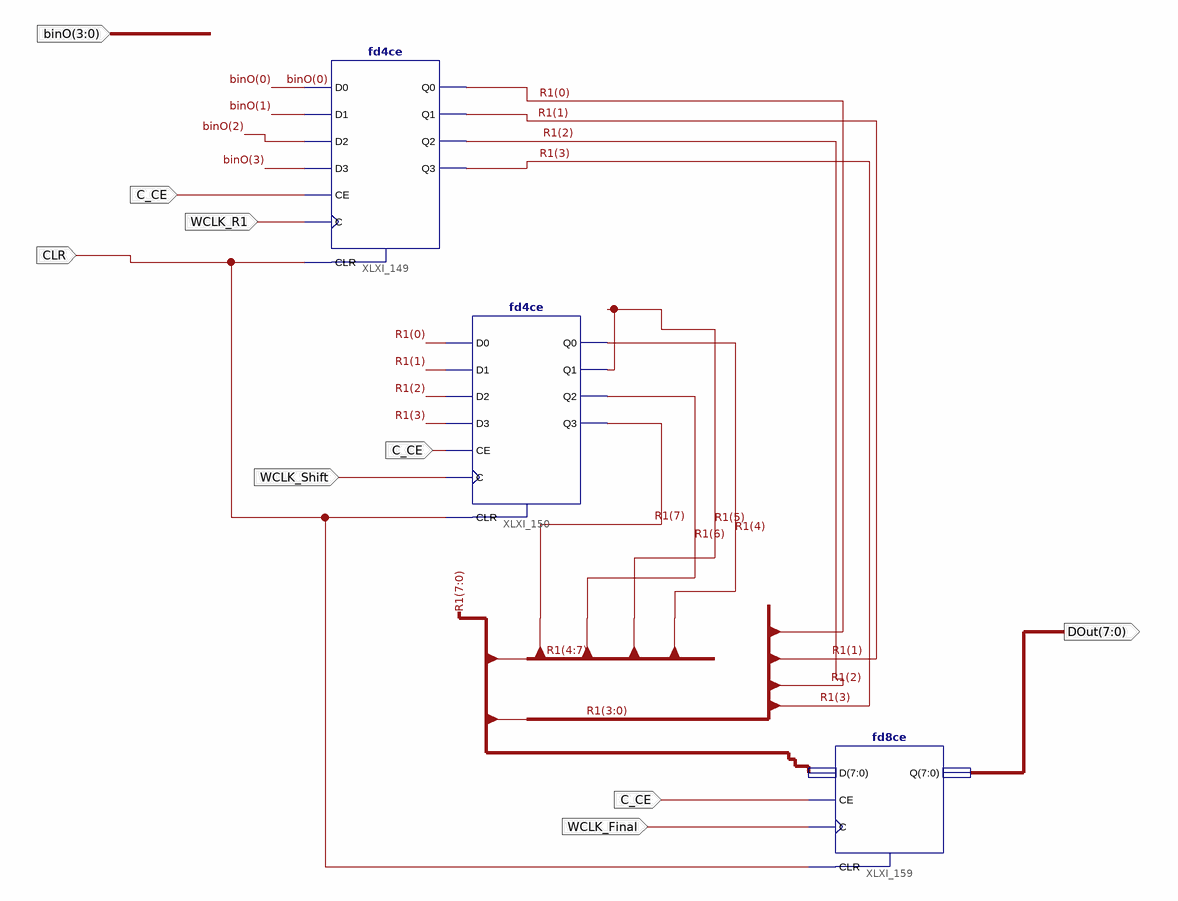
[diagram p0: schematic sheet 1]
// Xilinx ISE schematic Eight_Register_Shift.sch (spartan3e) as structural Verilog: 3 symbols, 7 ports
module Eight_Register_Shift (
  input  WCLK_Shift,
  input  C_CE,
  input  WCLK_R1,
  input  [3:0] binO,
  input  CLR,
  input  WCLK_Final,
  output [7:0] DOut
);

  wire [7:0] R1;

  fd4ce XLXI_150 (
    .C(WCLK_Shift), .CE(C_CE), .CLR(CLR), .D0(R1[0]), .D1(R1[1]), .D2(R1[2]), .D3(R1[3]), .Q0(R1[4]),
    .Q1(R1[5]), .Q2(R1[6]), .Q3(R1[7]));
  fd4ce XLXI_149 (
    .C(WCLK_R1), .CE(C_CE), .CLR(CLR), .D0(binO[0]), .D1(binO[1]), .D2(binO[2]), .D3(binO[3]), .Q0(R1[0]),
    .Q1(R1[1]), .Q2(R1[2]), .Q3(R1[3]));
  fd8ce XLXI_159 (.C(WCLK_Final), .CE(C_CE), .CLR(CLR), .D(R1), .Q(DOut));
endmodule
